# Altium schematic sheet vl822.SchDoc
size A3; SheetNumber: 4; SheetTotal: 4
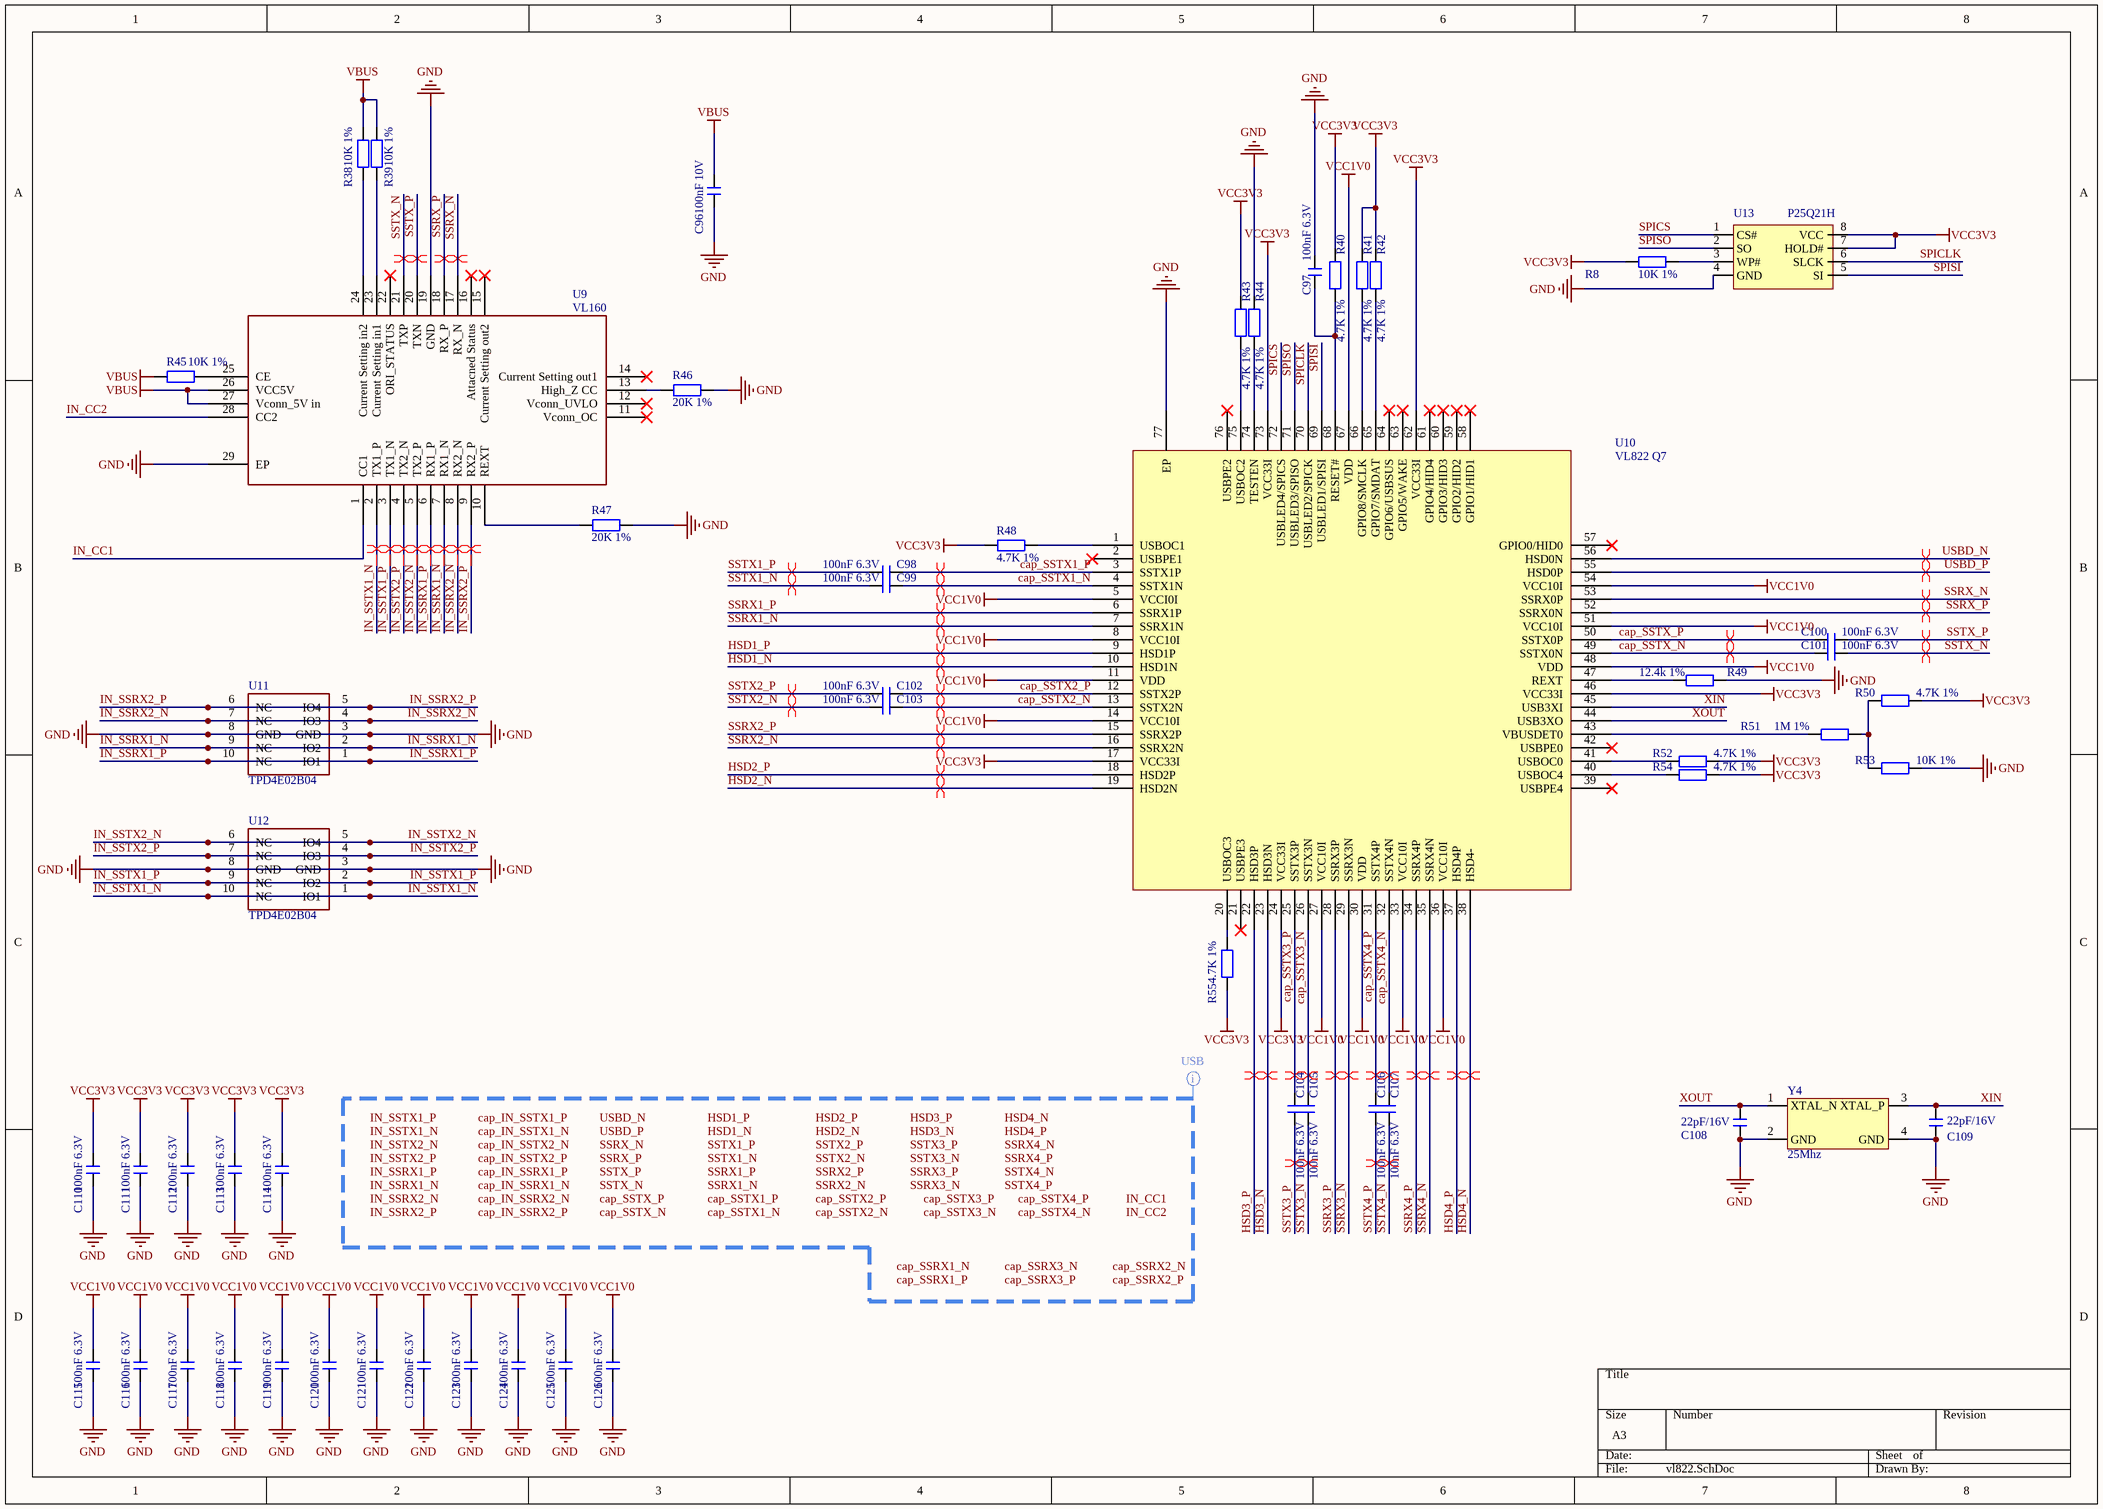
[diagram p0: vl822.SchDoc]

## Parts
C96  100nF 10V  [C0402_L]
C97  100nF 6.3V  [C0402_L]
C98  100nF 6.3V  [C0402_L]
C99  100nF 6.3V  [C0402_L]
C100  100nF 6.3V  [C0402_L]
C101  100nF 6.3V  [C0402_L]
C102  100nF 6.3V  [C0402_L]
C103  100nF 6.3V  [C0402_L]
C104  100nF 6.3V  [C0402_L]
C105  100nF 6.3V  [C0402_L]
C106  100nF 6.3V  [C0402_L]
C107  100nF 6.3V  [C0402_L]
C108  22pF/16V  [C0402_L]
C109  22pF/16V  [C0402_L]
C110  100nF 6.3V  [C0402_L]
C111  100nF 6.3V  [C0402_L]
C112  100nF 6.3V  [C0402_L]
C113  100nF 6.3V  [C0402_L]
C114  100nF 6.3V  [C0402_L]
C115  100nF 6.3V  [C0402_L]
C116  100nF 6.3V  [C0402_L]
C117  100nF 6.3V  [C0402_L]
C118  100nF 6.3V  [C0402_L]
C119  100nF 6.3V  [C0402_L]
C120  100nF 6.3V  [C0402_L]
C121  100nF 6.3V  [C0402_L]
C122  100nF 6.3V  [C0402_L]
C123  100nF 6.3V  [C0402_L]
C124  100nF 6.3V  [C0402_L]
C125  100nF 6.3V  [C0402_L]
C126  100nF 6.3V  [C0402_L]
R8  10K 1%  [R0402_L]
R38  10K 1%  [R0402_L]
R39  10K 1%  [R0402_L]
R40  4.7K 1%  [R0402_L]
R41  4.7K 1%  [R0402_L]
R42  4.7K 1%  [R0402_L]
R43  4.7K 1%  [R0402_L]
R44  4.7K 1%  [R0402_L]
R45  10K 1%  [R0402_L]
R46  20K 1%  [R0402_L]
R47  20K 1%  [R0402_L]
R48  4.7K 1%  [R0402_L]
R49  12.4k 1%  [R0402_L]
R50  4.7K 1%  [R0402_L]
R51  1M 1%  [R0402_L]
R52  4.7K 1%  [R0402_L]
R53  10K 1%  [R0402_L]
R54  4.7K 1%  [R0402_L]
R55  4.7K 1%  [R0402_L]
U9  VL160  [MQFN-28_L4.5-W3.5-P0.40-BL-EP]
U10  VL822 Q7  [QFN-76_L9.0-W9.0-P0.40-EP6.3-TL]
U11  TPD4E02B04  [DIO_TPD4E02B04DQAR]
U12  TPD4E02B04  [DIO_TPD4E02B04DQAR]
U13  P25Q21H  [SOP8_L]
Y4  25Mhz  [OSC 3225-4P]

## Nets
GND: C96.1 C97.2 C108.2 C109.2 C110.1 C111.1 C112.1 C113.1 C114.1 C115.1 C116.1 C117.1 C118.1 C119.1 C120.1 C121.1 C122.1 C123.1 C124.1 C125.1 C126.1 R44.2 R46.1 R47.1 R49.2 R53.2 U9.19(GND) U9.29(EP) U10.77(EP) U11.3(GND) U11.8(GND) U12.3(GND) U12.8(GND) U13.4(GND) Y4.2(GND) Y4.4(GND)
VBUS: C96.2 R38.1 R39.1 R45.2 U9.26(VCC5V) U9.27(Vconn_5V_in)
VCC1V0: C115.2 C116.2 C117.2 C118.2 C119.2 C120.2 C121.2 C122.2 C123.2 C124.2 C125.2 C126.2 U10.5(VCCI0I) U10.8(VCC10I) U10.11(VDD) U10.14(VCC10I) U10.27(VCC10I) U10.30(VDD) U10.33(VCC10I) U10.36(VCC10I) U10.48(VDD) U10.51(VCC10I) U10.54(VCC10I) U10.67(VDD)
VCC3V3: C110.2 C111.2 C112.2 C113.2 C114.2 R8.2 R40.2 R41.2 R42.2 R43.2 R48.2 R50.2 R52.2 R54.2 R55.2 U10.17(VCC33I) U10.24(VCC33I) U10.46(VCC33I) U10.62(VCC33I) U10.73(VCC33I) U13.7(HOLD#) U13.8(VCC)
cap_SSTX1_N: C99.2 U10.4(SSTX1N)
cap_SSTX1_P: C98.2 U10.3(SSTX1P)
cap_SSTX2_N: C103.2 U10.13(SSTX2N)
cap_SSTX2_P: C102.2 U10.12(SSTX2P)
cap_SSTX3_N: C105.2 U10.26(SSTX3N)
cap_SSTX3_P: C104.2 U10.25(SSTX3P)
cap_SSTX4_N: C107.2 U10.32(SSTX4N)
cap_SSTX4_P: C106.2 U10.31(SSTX4P)
cap_SSTX_N: C101.2 U10.49(SSTX0N)
cap_SSTX_P: C100.2 U10.50(SSTX0P)
HSD1_N: U10.10(HSD1N)
HSD1_P: U10.9(HSD1P)
HSD2_N: U10.19(HSD2N)
HSD2_P: U10.18(HSD2P)
HSD3_N: U10.23(HSD3N)
HSD3_P: U10.22(HSD3P)
HSD4_N: U10.38(HSD4-)
HSD4_P: U10.37(HSD4P)
IN_CC1: U9.1(CC1)
IN_CC2: U9.28(CC2)
IN_SSRX1_N: U9.7(RX1_N) U11.2(IO2) U11.9(NC)
IN_SSRX1_P: U9.6(RX1_P) U11.1(IO1) U11.10(NC)
IN_SSRX2_N: U9.8(RX2_N) U11.4(IO3) U11.7(NC)
IN_SSRX2_P: U9.9(RX2_P) U11.5(IO4) U11.6(NC)
IN_SSTX1_N: U9.2(TX1_P) U12.1(IO1) U12.10(NC)
IN_SSTX1_P: U9.3(TX1_N) U12.2(IO2) U12.9(NC)
IN_SSTX2_N: U9.5(TX2_P) U12.5(IO4) U12.6(NC)
IN_SSTX2_P: U9.4(TX2_N) U12.4(IO3) U12.7(NC)
SPICLK: U10.70(USBLED2/SPICK) U13.6(SLCK)
SPICS: U10.72(USBLED4/SPICS) U13.1(CS#)
SPISI: U10.69(USBLED1/SPISI) U13.5(SI)
SPISO: U10.71(USBLED3/SPISO) U13.2(SO)
SSRX1_N: U10.7(SSRX1N)
SSRX1_P: U10.6(SSRX1P)
SSRX2_N: U10.16(SSRX2N)
SSRX2_P: U10.15(SSRX2P)
SSRX3_N: U10.29(SSRX3N)
SSRX3_P: U10.28(SSRX3P)
SSRX4_N: U10.35(SSRX4N)
SSRX4_P: U10.34(SSRX4P)
SSRX_N: U9.17(RX_N) U10.53(SSRX0P)
SSRX_P: U9.18(RX_P) U10.52(SSRX0N)
SSTX1_N: C99.1
SSTX1_P: C98.1
SSTX2_N: C103.1
SSTX2_P: C102.1
SSTX3_N: C105.1
SSTX3_P: C104.1
SSTX4_N: C107.1
SSTX4_P: C106.1
SSTX_N: C101.1 U9.21(TXP)
SSTX_P: C100.1 U9.20(TXN)
USBD_N: U10.56(HSD0N)
USBD_P: U10.55(HSD0P)
XIN: C109.1 U10.45(USB3XI) Y4.3(XTAL_P)
XOUT: C108.1 U10.44(USB3XO) Y4.1(XTAL_N)
NetC97_1: C97.1 R40.1 U10.68(RESET#)
NetR8_1: R8.1 U13.3(WP#)
NetR38_2: R38.2 U9.24(Current_Setting_in2)
NetR39_2: R39.2 U9.23(Current_Setting_in1)
NetR41_1: R41.1 U10.66(GPIO8/SMCLK)
NetR42_1: R42.1 U10.65(GPIO7/SMDAT)
NetR43_1: R43.1 U10.75(USBOC2)
NetR44_1: R44.1 U10.74(TESTEN)
NetR45_1: R45.1 U9.25(CE)
NetR46_2: R46.2 U9.13(High_Z_CC)
NetR47_2: R47.2 U9.10(REXT)
NetR48_1: R48.1 U10.1(USBOC1)
NetR49_1: R49.1 U10.47(REXT)
NetR50_1: R50.1 R51.2 R53.1
NetR51_1: R51.1 U10.43(VBUSDET0)
NetR52_1: R52.1 U10.41(USBOC0)
NetR54_1: R54.1 U10.40(USBOC4)
NetR55_1: R55.1 U10.20(USBOC3)

Not connected (* = marked no-connect by the designer): U9 11(Vconn_OC)* 12(Vconn_UVLO)* 14(Current_Setting_out1)* 15(Current_Setting_out2)* 16(Attacned_Status)* 22(ORI_STATUS)*; U10 2(USBPE1)* 21(USBPE3)* 39(USBPE4)* 42(USBPE0)* 57(GPIO0/HID0)* 58(GPIO1/HID1)* 59(GPIO2/HID2)* 60(GPIO3/HID3)* 61(GPIO4/HID4)* 63(GPIO5/WAKE)* 64(GPIO6/USBSUS)* 76(USBPE2)*

## Layout directives
differential pair: cap_SSTX1_N, cap_SSTX1_P, cap_SSTX2_N, cap_SSTX2_P, cap_SSTX3_N, cap_SSTX3_P, cap_SSTX4_N, cap_SSTX4_P, cap_SSTX_N, cap_SSTX_P, HSD1_N, HSD1_P, HSD2_N, HSD2_P, HSD3_N, HSD3_P, HSD4_N, HSD4_P, IN_SSRX1_N, IN_SSRX1_P, IN_SSRX2_N, IN_SSRX2_P, IN_SSTX1_N, IN_SSTX1_P, IN_SSTX2_N, IN_SSTX2_P, SSRX1_N, SSRX1_P, SSRX2_N, SSRX2_P, SSRX3_N, SSRX3_P, SSRX4_N, SSRX4_P, SSRX_N, SSRX_P, SSTX1_N, SSTX1_P, SSTX2_N, SSTX2_P, SSTX3_N, SSTX3_P, SSTX4_N, SSTX4_P, SSTX_N, SSTX_P, USBD_N, USBD_P
net class USB; rule Differential Pairs Routing [Pref Gap = 5mil    Min Gap  = 5mil    Max Gap  = 5milPref Width = 5.1mil    Min Width  = 5.1mil    Max Width  = 5.1mil]; rule Routing Via Style [Pref Size = 0.4mm    Pref Hole Size = 0.3mm]: cap_IN_SSRX1_N, cap_IN_SSRX1_P, cap_IN_SSRX2_N, cap_IN_SSRX2_P, cap_IN_SSTX1_N, cap_IN_SSTX1_P, cap_IN_SSTX2_N, cap_IN_SSTX2_P, cap_SSRX1_N, cap_SSRX1_P, cap_SSRX2_N, cap_SSRX2_P, cap_SSRX3_N, cap_SSRX3_P, cap_SSTX1_N, cap_SSTX1_P, cap_SSTX2_N, cap_SSTX2_P, cap_SSTX3_N, cap_SSTX3_P, cap_SSTX4_N, cap_SSTX4_P, cap_SSTX_N, cap_SSTX_P, HSD1_N, HSD1_P, HSD2_N, HSD2_P, HSD3_N, HSD3_P, HSD4_N, HSD4_P, IN_CC1, IN_CC2, IN_SSRX1_N, IN_SSRX1_P, IN_SSRX2_N, IN_SSRX2_P, IN_SSTX1_N, IN_SSTX1_P, IN_SSTX2_N, IN_SSTX2_P, SSRX1_N, SSRX1_P, SSRX2_N, SSRX2_P, SSRX3_N, SSRX3_P, SSRX4_N, SSRX4_P, SSRX_N, SSRX_P, SSTX1_N, SSTX1_P, SSTX2_N, SSTX2_P, SSTX3_N, SSTX3_P, SSTX4_N, SSTX4_P, SSTX_N, SSTX_P, USBD_N, USBD_P

## Notes on the sheet
- Labels drawn without touching a wire or pin: cap_IN_SSRX1_N, cap_IN_SSRX1_P, cap_IN_SSRX2_N, cap_IN_SSRX2_P, cap_IN_SSTX1_N, cap_IN_SSTX1_P, cap_IN_SSTX2_N, cap_IN_SSTX2_P, cap_SSRX1_N, cap_SSRX1_P, cap_SSRX2_N, cap_SSRX2_P, cap_SSRX3_N, cap_SSRX3_P, cap_SSTX1_N, cap_SSTX1_P, cap_SSTX2_N, cap_SSTX2_P, cap_SSTX3_N, cap_SSTX3_P, cap_SSTX4_N, cap_SSTX4_P, cap_SSTX_N, cap_SSTX_P, HSD1_N, HSD1_P, HSD2_N, HSD2_P, HSD3_N, HSD3_P, HSD4_N, HSD4_P, IN_CC1, IN_CC2, IN_SSRX1_N, IN_SSRX1_P, IN_SSRX2_N, IN_SSRX2_P, IN_SSTX1_N, IN_SSTX1_P, IN_SSTX2_N, IN_SSTX2_P, SSRX1_N, SSRX1_P, SSRX2_N, SSRX2_P, SSRX3_N, SSRX3_P, SSRX4_N, SSRX4_P, SSRX_N, SSRX_P, SSTX1_N, SSTX1_P, SSTX2_N, SSTX2_P, SSTX3_N, SSTX3_P, SSTX4_N, SSTX4_P, SSTX_N, SSTX_P, USBD_N, USBD_P

## Library data of the parts
C96-C126 = C: 无极性贴片电容; 版权归属: 源创客; 材质: X7R; BOM名称: 无极性贴片电容; 学习资源: www.ooocke.com
R8 R38-R55 = R: 贴片电阻; 版权归属: 源创客; BOM名称: 贴片电阻; 学习资源: www.ooocke.com
U11 U12 = TPD4E02B04: ESD
U13 = P25D40H
Y4 = Crystal